# Altium schematic sheet source_of_current_hall_crossboard_1_1.SchDoc
size A4
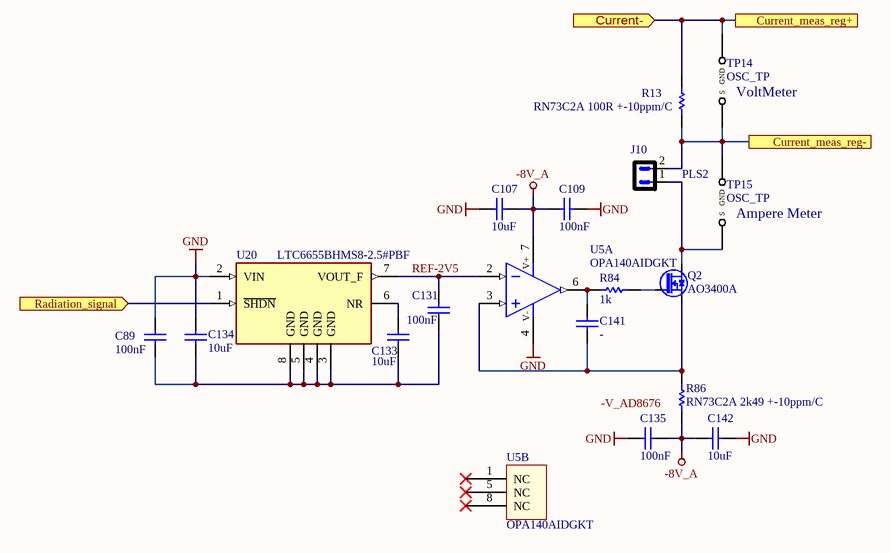
[diagram p0: source_of_current_hall_crossboard_1_1.SchDoc]

## Parts
C89  100nF  [0603C]
C107  10uF  [0805C]
C109  100nF  [0603C]
C131  100nF  [0603C]
C133  10uF  [0805C]
C134  10uF  [0805C]
C135  100nF  [0603C]
C141  -  [0603C]
C142  10uF  [0805C]
J10  PLS2  [SAMTEC_TSW-102-23-L-S]
Q2  AO3400A  [SOT95P229X119-3N]
R13  RN73C2A 100R +-10ppm/C  [0805R]
R84  1k  [0805R]
R86  RN73C2A 2k49 +-10ppm/C  [0805R]
TP14  OSC_TP  [TP2]
TP15  OSC_TP  [TP2]
U5  OPA140AIDGKT  [SOP65P490X110-8N]  (parts A,B of 2)
U20  LTC6655BHMS8-2.5#PBF  [SOP65P490X110-8N]

## Ports
Current- (in), Current_meas_reg+, Current_meas_reg-, Radiation_signal (in)

## Nets
-8V_A: C107.1 C109.1 C135.1 C142.1 R86.1 U5.7(V+)
GND: C89.2 C107.2 C109.2 C134.2 C135.2 C142.2 U5.4(V-) U20.2(VIN)
Current-: R13.2 TP14.2(GND) ; port Current-, port Current_meas_reg+
Current_meas_reg-: J10.2 R13.1 TP14.1(S) TP15.2(GND) ; port Current_meas_reg-
Radiation_signal: U20.1(~{SHDN}) ; port Radiation_signal
REF-2V5: C131.2 U5.2(IN-) U20.7(VOUT_F)
NetC89_1: C89.1 C131.1 C133.1 C134.1 U20.3(GND) U20.4(GND) U20.5(GND) U20.8(GND)
NetC133_2: C133.2 U20.6(NR)
NetC141_1: C141.1 Q2.2(S) R86.2 U5.3(IN+)
NetC141_2: C141.2 R84.1 U5.6(OUT)
NetJ10_1: J10.1 Q2.3(D) TP15.1(S)
NetQ2_1: Q2.1(G) R84.2

Not connected (* = marked no-connect by the designer): U5 1(NC)* 5(NC)* 8(NC)*

## Notes on the sheet
- (near TP14) VoltMeter
- (near TP15) Ampere Meter
- Labels drawn without touching a wire or pin: -V_AD8676

## Library data of the parts
C89 C107 C109 C131 C133-C135 C142 = Capacitor_ST: Capacitor 0402 / 0603 / 0805; Revision: July-2002: Re-released for DXP Platform.
  C89 C109 C131 C135: Value: 100nF
  C107 C133 C134 C142: Value: 10uF
C141 = Capacitor_ST: Capacitor 0402 / 0603 / 0805; Value: 100nF; Revision: July-2002: Re-released for DXP Platform.
J10 = PLS2: Vendor: Confly; SMD Solders: 0; Solder Option: RM; THD Solders: 2; Price: 1; Device: PLS2
Q2 = AO3400A: NMOS; Vendor: UMW; Pkg: SOT23; SMD Solders: 3; Solder Option: RM; Voltage: 30V; Price: 10; Device: AO3400A; Name to order: AO3400A
R13 R86 = Resistor_ST: Resistor 0402 / 0603 / 0805; Value: 10K
R84 = Resistor_ST: Resistor 0402 / 0603 / 080; Value: 1k
TP14 TP15 = OscTP: Контрольная точка для подключения осциллографа короткой землёй; Vendor: PCB; Step: 2; Price: 0; Value: OSC_TP; SolderOption: PCB
U5 = OPA140AIDGKT: Single, 11MHz, Single Supply, Low Noise, Precision, Rail-to-Rail Output, JFET Amplifier 8-VSSOP -40 to 125; MF: Texas Instruments; Purchase-URL: https://pricing.snapeda.com/search/part/OPA140AIDGKT/?ref=eda; SnapEDA_Link: https://www.snapeda.com/parts/OPA140AIDGKT/Texas%20Instruments/view-part/515779/?ref=snap; Value: *; MP: OPA140AIDGKT; Package: VSSOP-8 Texas Instruments; Check_prices: https://www.snapeda.com/parts/OPA140AIDGKT/Texas%20Instruments/view-part/515779/?ref=eda; Price: None; Availability: Good
U20 = LTC6655BHMS8-5#PBF: Series Voltage Reference IC Fixed 5V V Â±0.025% 5 mA 8-MSOP; MF: Analog Devices; Purchase-URL: https://pricing.snapeda.com/search/part/LTC6655BHMS8-5#PBF/?ref=eda; Check_prices: https://www.snapeda.com/parts/LTC6655BHMS8-5%23PBF/Analog+Devices/view-part/?ref=eda; Value: *; SnapEDA_Link: https://www.snapeda.com/parts/LTC6655BHMS8-5%23PBF/Analog+Devices/view-part/?ref=snap; Package: None; Availability: In Stock; Price: None; MP: LTC6655BHMS8-5#PBF